# Altium schematic sheet Sheet1.SchDoc
size A4
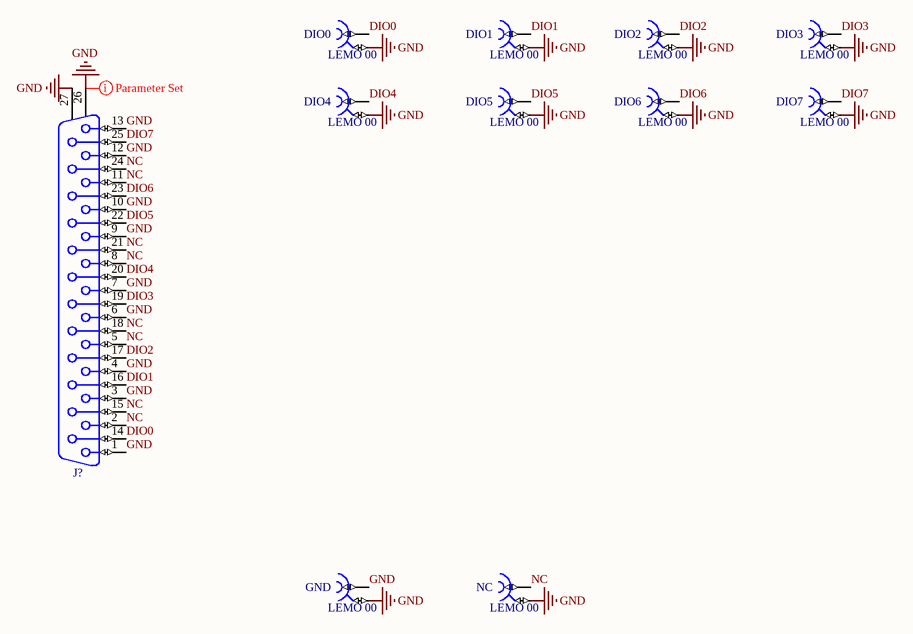
[diagram p0: Sheet1.SchDoc]

## Parts
DIO0  LEMO 00  [LEMO_EPA.00.250.NTN]
DIO1  LEMO 00  [LEMO_EPA.00.250.NTN]
DIO2  LEMO 00  [LEMO_EPA.00.250.NTN]
DIO3  LEMO 00  [LEMO_EPA.00.250.NTN]
DIO4  LEMO 00  [LEMO_EPA.00.250.NTN]
DIO5  LEMO 00  [LEMO_EPA.00.250.NTN]
DIO6  LEMO 00  [LEMO_EPA.00.250.NTN]
DIO7  LEMO 00  [LEMO_EPA.00.250.NTN]
GND  LEMO 00  [LEMO_EPA.00.250.NTN]
J?  D-SUB25F  [NORCOMP_172-025-242R011]  (value not drawn)
NC  LEMO 00  [LEMO_EPA.00.250.NTN]

## Nets
GND: DIO0.2 DIO1.2 DIO2.2 DIO3.2 DIO4.2 DIO5.2 DIO6.2 DIO7.2 GND.1 GND.2 J?.1 J?.3 J?.4 J?.6 J?.7 J?.9 J?.10 J?.12 J?.13 J?.26 J?.27 NC.2
\: J?.2 J?.5 J?.8 J?.11 J?.15 J?.18 J?.21 J?.24 NC.1  [also labelled NC]
DIO0: DIO0.1 J?.14
DIO1: DIO1.1 J?.16
DIO2: DIO2.1 J?.17
DIO3: DIO3.1 J?.19
DIO4: DIO4.1 J?.20
DIO5: DIO5.1 J?.22
DIO6: DIO6.1 J?.23
DIO7: DIO7.1 J?.25

## Layout directives
rule Routing Layers [TopLayer - DisabledBottomLayer - Enabled ]: GND

## Library data of the parts
DIO0-DIO7 GND NC = LEMO_EPA.00.250.NTN: Part Description: Size 00, 50 Ohms Coaxial Straight socket; PressFit: No; SCEM: 09.46.11.184.2; Part Number: LEMO_EPA.00.250.NTN; Component Kind: Standard; Component Type: Standard; Pin Count: 2; Family: LEMO 00; Mounted: Yes; Socket: No; SMD: No; Sense: No; Status: None; Manufacturer: LEMO; Manufacturer Part Number: EPA.00.250.NTN; ComponentHeight: 14mm; HelpURL: \\cern.ch\dfs\Applications\Altium\Datasheets\LEMO_EPA.00.250.NTN.pdf; Author: CERN DEM JLC; CreateDate: 22/04/2008; LatestRevisionDate: 22/04/2008
J? = NORCOMP_172-025-242R011: Connector D-sub 25 Female; Part Description: Straight Wire Wrap D-Sub 25 Contacts Female Connector With 0.065"Clinch Nut (Board Side); PressFit: No; Part Number: NORCOMP_172-025-242R011; Component Kind: Standard; Component Type: Standard; Pin Count: 27; Family: D-SUB25F; Mounted: Yes; Socket: No; SMD: No; Sense: No; Status: None; Manufacturer: NORCOMP; Manufacturer Part Number: 172-025-242R011; ComponentHeight: 12.08mm; HelpURL: \\cern.ch\dfs\Applications\Altium\Datasheets\NORCOMP_172-025-242R011.pdf; Author: CERN DEM JLC; CreateDate: 13/06/2013; LatestRevisionDate: 13/06/2013